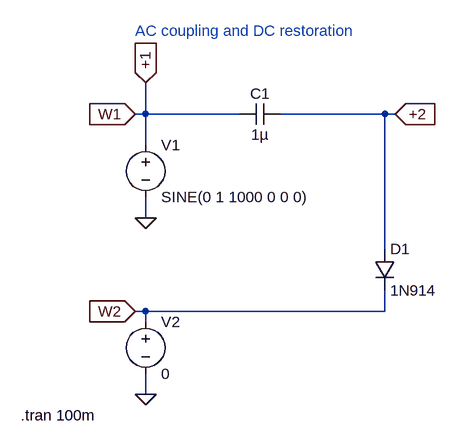
[diagram p0: schematic ac_coupl_dc_rest.asc]
ac_coupl_dc_rest.asc, the LTspice schematic file:
Version 4
SHEET 1 880 680
WIRE 48 48 48 0
WIRE 48 48 32 48
WIRE 192 48 48 48
WIRE 416 48 256 48
WIRE 432 48 416 48
WIRE 48 96 48 48
WIRE 48 208 48 176
WIRE 416 256 416 48
WIRE 48 352 32 352
WIRE 416 352 416 320
WIRE 416 352 48 352
WIRE 48 368 48 352
WIRE 48 480 48 448
FLAG 48 208 0
FLAG 48 480 0
FLAG 32 48 W1
IOPIN 32 48 In
FLAG 32 352 W2
IOPIN 32 352 In
FLAG 48 0 +1
IOPIN 48 0 In
FLAG 432 48 +2
IOPIN 432 48 In
SYMBOL diode 400 256 R0
SYMATTR InstName D1
SYMATTR Value 1N914
SYMBOL voltage 48 80 R0
WINDOW 123 0 0 Left 0
WINDOW 39 0 0 Left 0
SYMATTR InstName V1
SYMATTR Value SINE(0 1 1000 0 0 0)
SYMBOL cap 256 32 R90
WINDOW 0 0 32 VBottom 2
WINDOW 3 32 32 VTop 2
SYMATTR InstName C1
SYMATTR Value 1µ
SYMBOL voltage 48 352 R0
WINDOW 123 0 0 Left 0
WINDOW 39 0 0 Left 0
SYMATTR InstName V2
SYMATTR Value 0
TEXT 32 -80 Left 2 ;AC coupling and DC restoration
TEXT -144 512 Left 2 !.tran 100m

The netlist it stands for:
* ac_coupl_dc_rest.asc
D1 +2 W2 1N914
V1 +1 0 SINE(0 1 1000 0 0 0)
C1 +2 +1 1µ
V2 W2 0 0
.model D D
.lib standard.dio
* AC coupling and DC restoration
.tran 100m
.backanno
.end